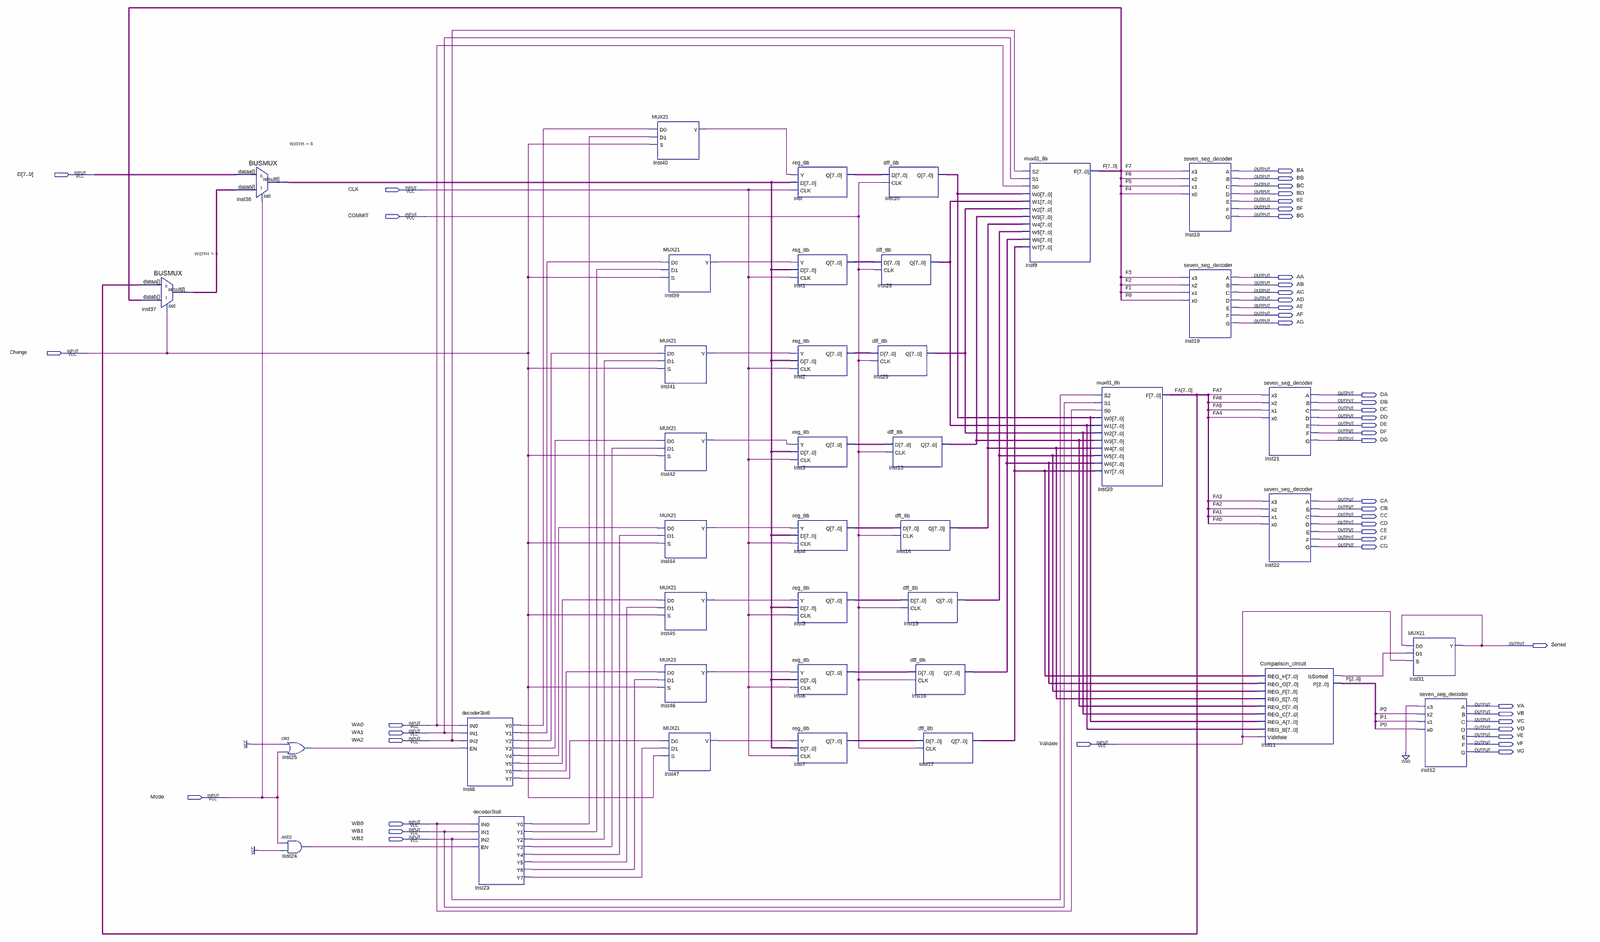
[diagram p0: schematic sheet, whole]
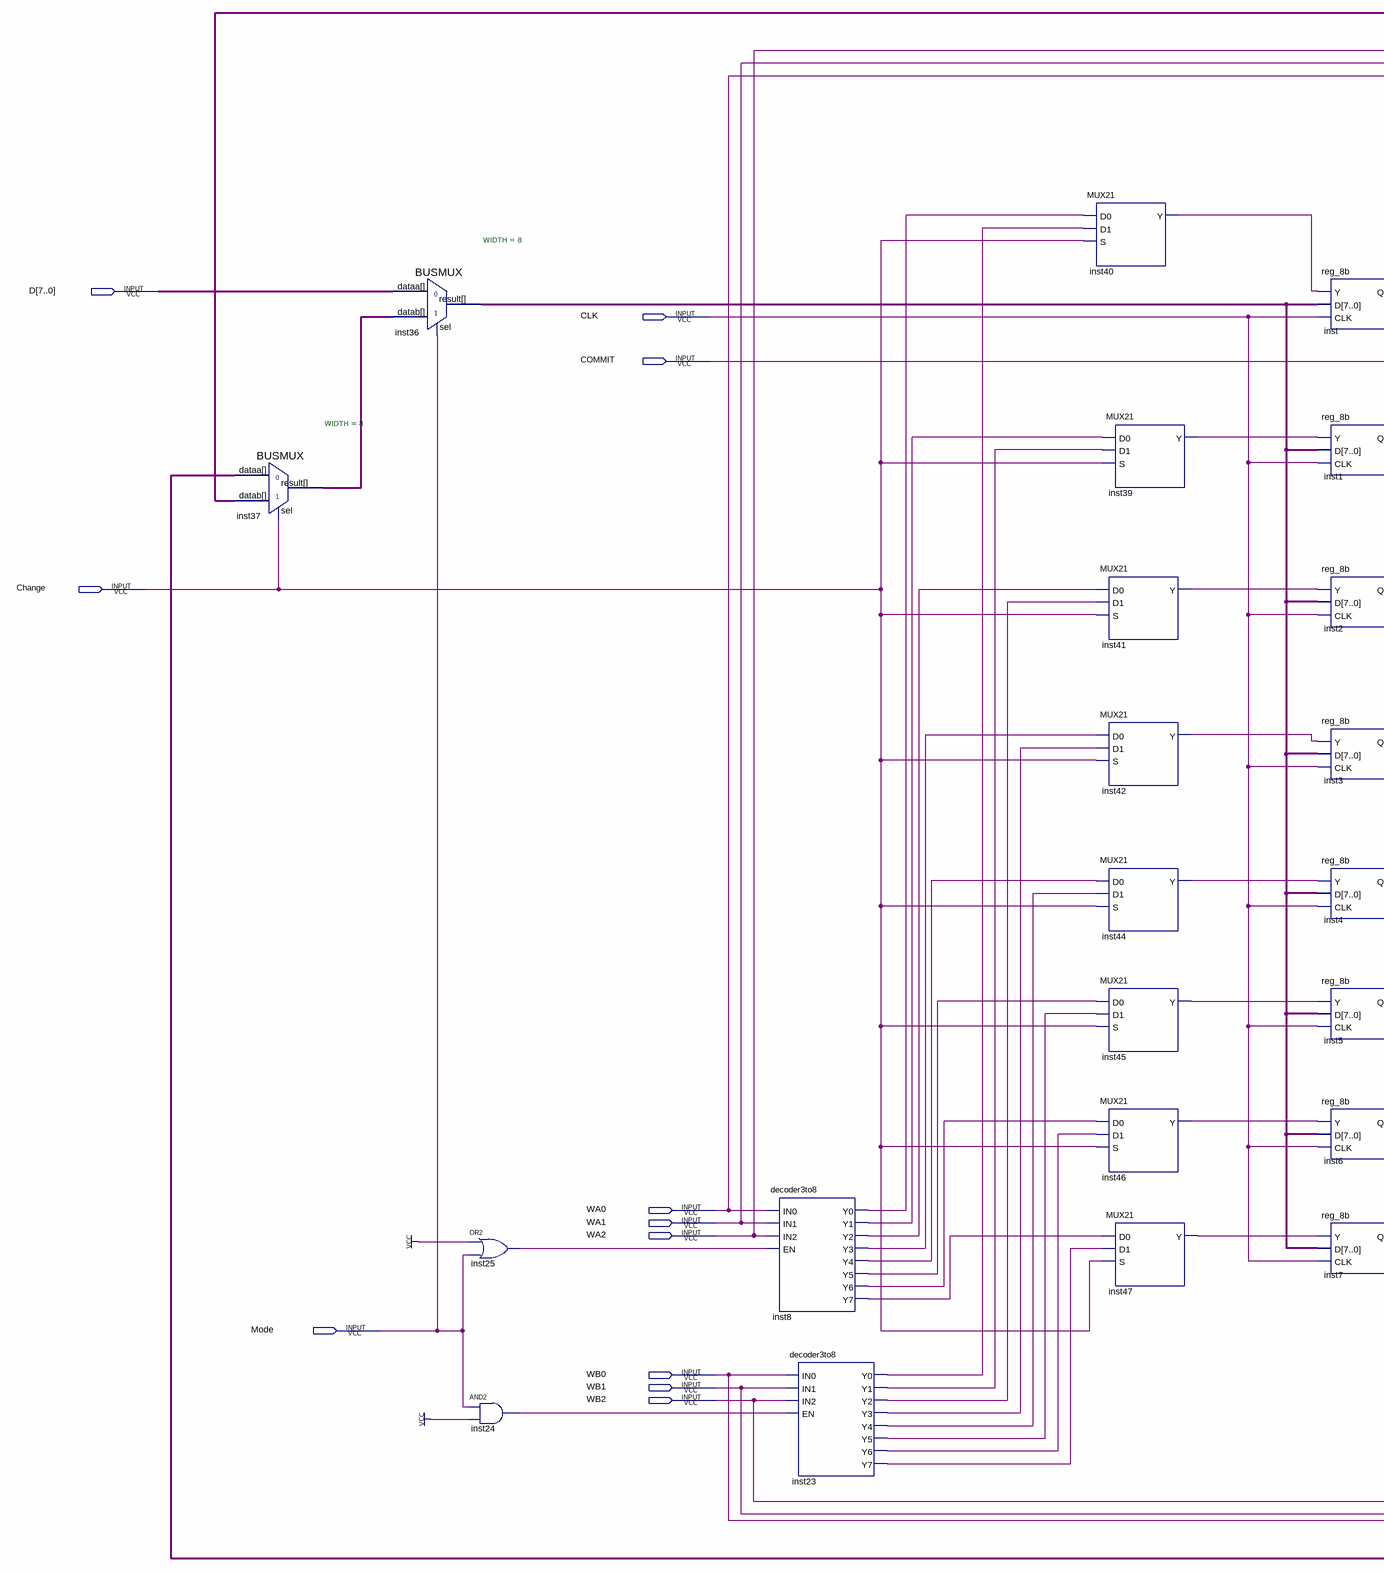
[diagram p1: schematic sheet, left part]
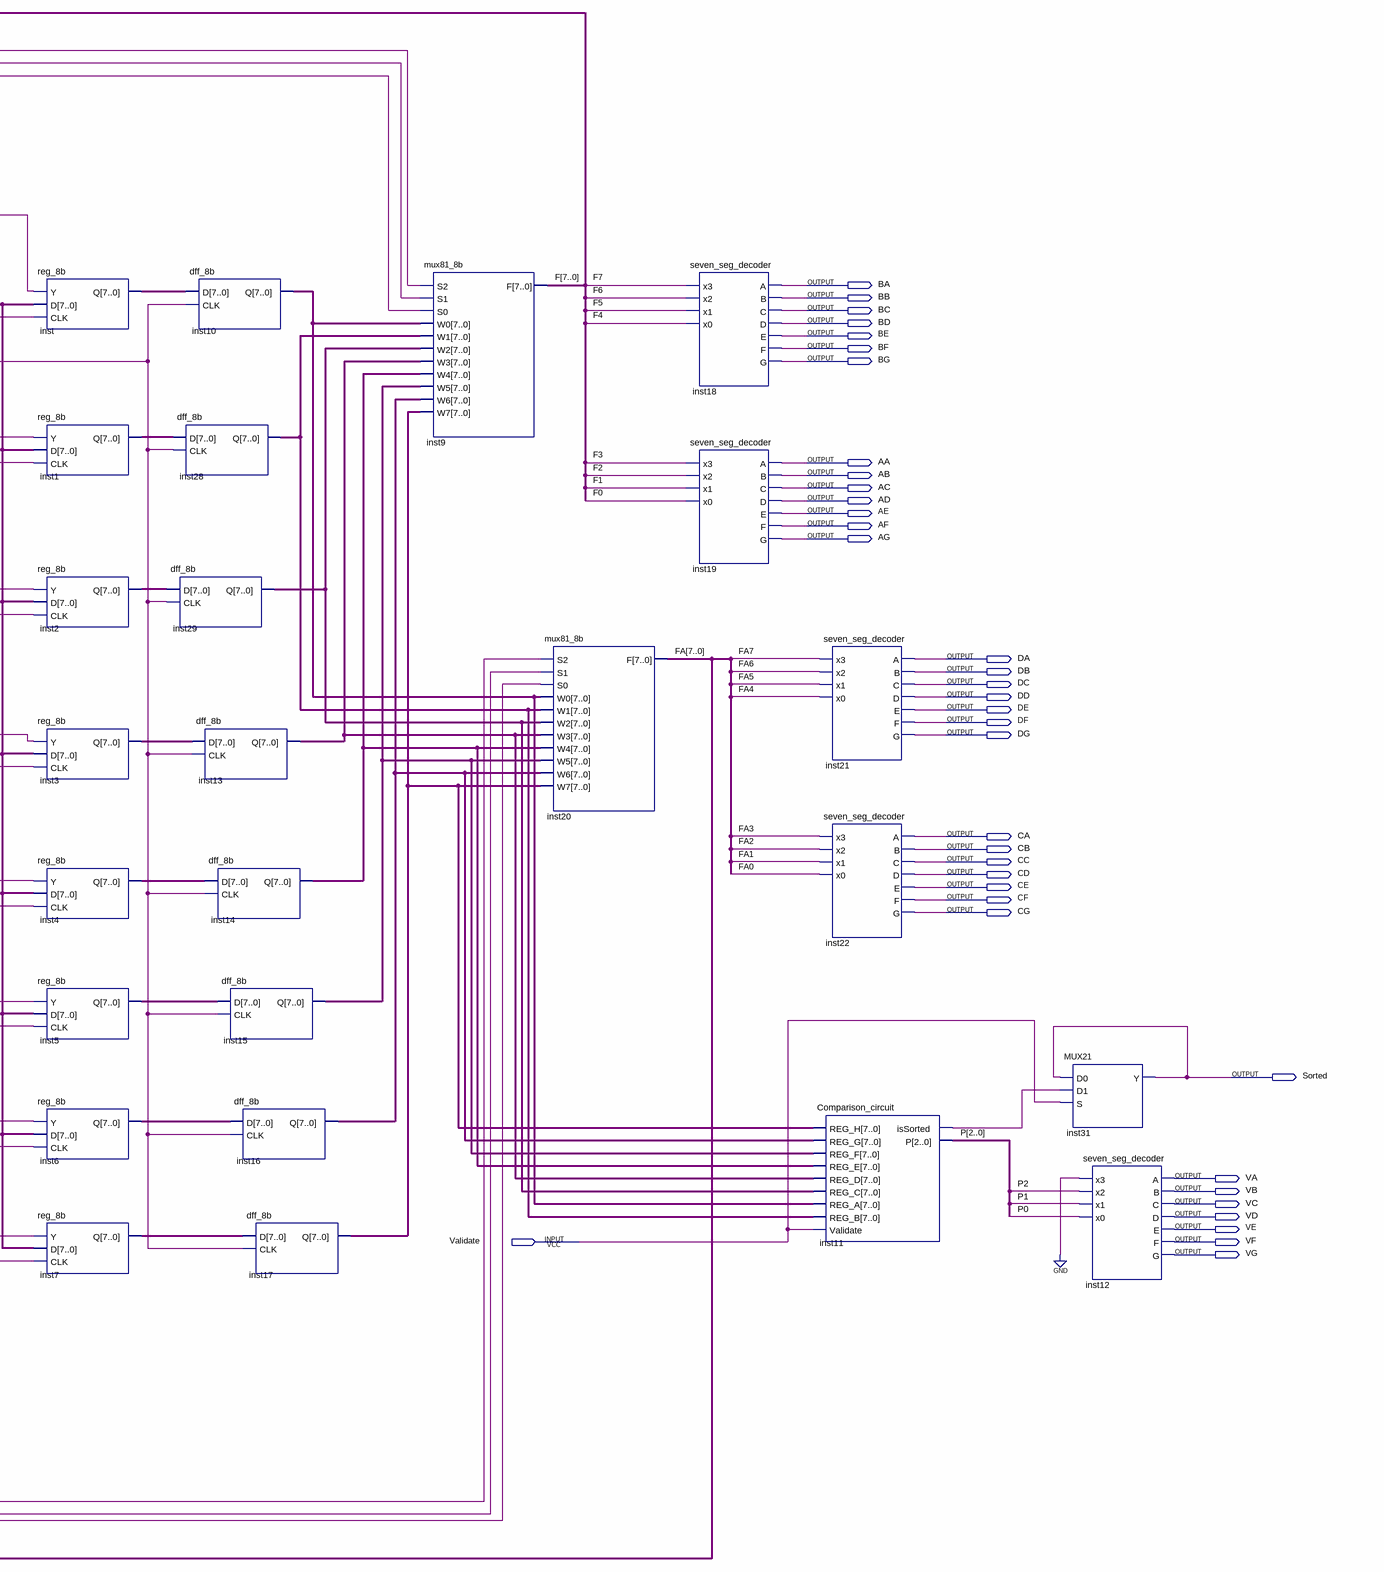
[diagram p2: schematic sheet, right part]
// Quartus schematic regFile.bdf as structural Verilog: 39 symbols, 48 pins
module regFile (
  input  [7:0] D,
  input  CLK,
  input  COMMIT,
  input  Change,
  input  WA0,
  input  WA1,
  input  WA2,
  input  Validate,
  input  Mode,
  input  WB0,
  input  WB1,
  input  WB2,
  output BA,
  output BB,
  output BC,
  output BD,
  output BE,
  output BF,
  output BG,
  output AA,
  output AB,
  output AC,
  output AD,
  output AE,
  output AF,
  output AG,
  output DA,
  output DB,
  output DC,
  output DD,
  output DE,
  output DF,
  output DG,
  output CA,
  output CB,
  output CC,
  output CD,
  output CE,
  output CF,
  output CG,
  output Sorted,
  output VA,
  output VB,
  output VC,
  output VD,
  output VE,
  output VF,
  output VG
);

  wire inst8_y0, inst8_y1, inst8_y2, inst8_y3, inst8_y4, inst8_y5, inst8_y6, inst8_y7, inst11_issorted,
       inst23_y0, inst23_y1, inst23_y2, inst23_y3, inst23_y4, inst23_y5, inst23_y6, inst23_y7, inst24_out,
       inst25_out, inst39_y, inst40_y, inst41_y, inst42_y, inst44_y, inst45_y, inst46_y, inst47_y;
  wire [2:0] P;
  wire [7:0] F, FA, inst1_q, inst2_q, inst3_q, inst4_q, inst5_q, inst6_q, inst7_q, inst10_q, inst13_q,
       inst14_q, inst15_q, inst16_q, inst17_q, inst28_q, inst29_q, inst36_result, inst37_result, inst_q;

  BUSMUX #(.WIDTH(8)) inst37 (.datab(F), .sel(Change), .dataa(FA), .result(inst37_result));
  BUSMUX #(.WIDTH(8)) inst36 (.datab(inst37_result), .sel(Mode), .dataa(D), .result(inst36_result));
  or inst25 (inst25_out, 1'b1, Mode);
  and inst24 (inst24_out, Mode, 1'b1);
  decoder3to8 inst8 (
    .IN0(WA0), .IN1(WA1), .IN2(WA2), .EN(inst25_out), .Y0(inst8_y0), .Y1(inst8_y1), .Y2(inst8_y2),
    .Y3(inst8_y3), .Y4(inst8_y4), .Y5(inst8_y5), .Y6(inst8_y6), .Y7(inst8_y7));
  decoder3to8 inst23 (
    .IN0(WB0), .IN1(WB1), .IN2(WB2), .EN(inst24_out), .Y0(inst23_y0), .Y1(inst23_y1), .Y2(inst23_y2),
    .Y3(inst23_y3), .Y4(inst23_y4), .Y5(inst23_y5), .Y6(inst23_y6), .Y7(inst23_y7));
  MUX21 inst40 (.D0(inst8_y0), .D1(inst23_y0), .S(Change), .Y(inst40_y));
  MUX21 inst39 (.D0(inst8_y1), .D1(inst23_y1), .S(Change), .Y(inst39_y));
  MUX21 inst41 (.D0(inst8_y2), .D1(inst23_y2), .S(Change), .Y(inst41_y));
  MUX21 inst42 (.D0(inst8_y3), .D1(inst23_y3), .S(Change), .Y(inst42_y));
  MUX21 inst44 (.D0(inst8_y4), .D1(inst23_y4), .S(Change), .Y(inst44_y));
  MUX21 inst45 (.D0(inst8_y5), .D1(inst23_y5), .S(Change), .Y(inst45_y));
  MUX21 inst46 (.D0(inst8_y6), .D1(inst23_y6), .S(Change), .Y(inst46_y));
  MUX21 inst47 (.D0(inst8_y7), .D1(inst23_y7), .S(Change), .Y(inst47_y));
  reg_8b inst (.Y(inst40_y), .D(inst36_result), .CLK(CLK), .Q(inst_q));
  reg_8b inst1 (.Y(inst39_y), .D(inst36_result), .CLK(CLK), .Q(inst1_q));
  reg_8b inst2 (.Y(inst41_y), .D(inst36_result), .CLK(CLK), .Q(inst2_q));
  reg_8b inst3 (.Y(inst42_y), .D(inst36_result), .CLK(CLK), .Q(inst3_q));
  reg_8b inst4 (.Y(inst44_y), .D(inst36_result), .CLK(CLK), .Q(inst4_q));
  reg_8b inst5 (.Y(inst45_y), .D(inst36_result), .CLK(CLK), .Q(inst5_q));
  reg_8b inst6 (.Y(inst46_y), .D(inst36_result), .CLK(CLK), .Q(inst6_q));
  reg_8b inst7 (.Y(inst47_y), .D(inst36_result), .CLK(CLK), .Q(inst7_q));
  dff_8b inst10 (.D(inst_q), .CLK(COMMIT), .Q(inst10_q));
  dff_8b inst28 (.D(inst1_q), .CLK(COMMIT), .Q(inst28_q));
  dff_8b inst29 (.D(inst2_q), .CLK(COMMIT), .Q(inst29_q));
  dff_8b inst13 (.D(inst3_q), .CLK(COMMIT), .Q(inst13_q));
  dff_8b inst14 (.D(inst4_q), .CLK(COMMIT), .Q(inst14_q));
  dff_8b inst15 (.D(inst5_q), .CLK(COMMIT), .Q(inst15_q));
  dff_8b inst16 (.D(inst6_q), .CLK(COMMIT), .Q(inst16_q));
  dff_8b inst17 (.D(inst7_q), .CLK(COMMIT), .Q(inst17_q));
  mux81_8b inst9 (
    .S2(WA2), .S1(WA1), .S0(WA0), .W0(inst10_q), .W1(inst28_q), .W2(inst29_q), .W3(inst13_q), .W4(inst14_q),
    .W5(inst15_q), .W6(inst16_q), .W7(inst17_q), .F(F));
  mux81_8b inst20 (
    .S2(WB2), .S1(WB1), .S0(WB0), .W0(inst10_q), .W1(inst28_q), .W2(inst29_q), .W3(inst13_q), .W4(inst14_q),
    .W5(inst15_q), .W6(inst16_q), .W7(inst17_q), .F(FA));
  seven_seg_decoder inst18 (
    .x3(F[7]), .x2(F[6]), .x1(F[5]), .x0(F[4]), .A(BA), .B(BB), .C(BC), .D(BD), .E(BE), .F(BF), .G(BG));
  seven_seg_decoder inst19 (
    .x3(F[3]), .x2(F[2]), .x1(F[1]), .x0(F[0]), .A(AA), .B(AB), .C(AC), .D(AD), .E(AE), .F(AF), .G(AG));
  seven_seg_decoder inst21 (
    .x3(FA[7]), .x2(FA[6]), .x1(FA[5]), .x0(FA[4]), .A(DA), .B(DB), .C(DC), .D(DD), .E(DE), .F(DF), .G(DG));
  seven_seg_decoder inst22 (
    .x3(FA[3]), .x2(FA[2]), .x1(FA[1]), .x0(FA[0]), .A(CA), .B(CB), .C(CC), .D(CD), .E(CE), .F(CF), .G(CG));
  Comparison_circuit inst11 (
    .REG_H(inst17_q), .REG_G(inst16_q), .REG_F(inst15_q), .REG_E(inst14_q), .REG_D(inst13_q),
    .REG_C(inst29_q), .REG_A(inst10_q), .REG_B(inst28_q), .Validate(Validate), .isSorted(inst11_issorted),
    .P(P));
  MUX21 inst31 (.D0(Sorted), .D1(inst11_issorted), .S(Validate), .Y(Sorted));
  seven_seg_decoder inst12 (
    .x3(1'b0), .x2(P[2]), .x1(P[1]), .x0(P[0]), .A(VA), .B(VB), .C(VC), .D(VD), .E(VE), .F(VF), .G(VG));
endmodule
